# EAGLE design eyewriter_01 (EAGLE 5.11)
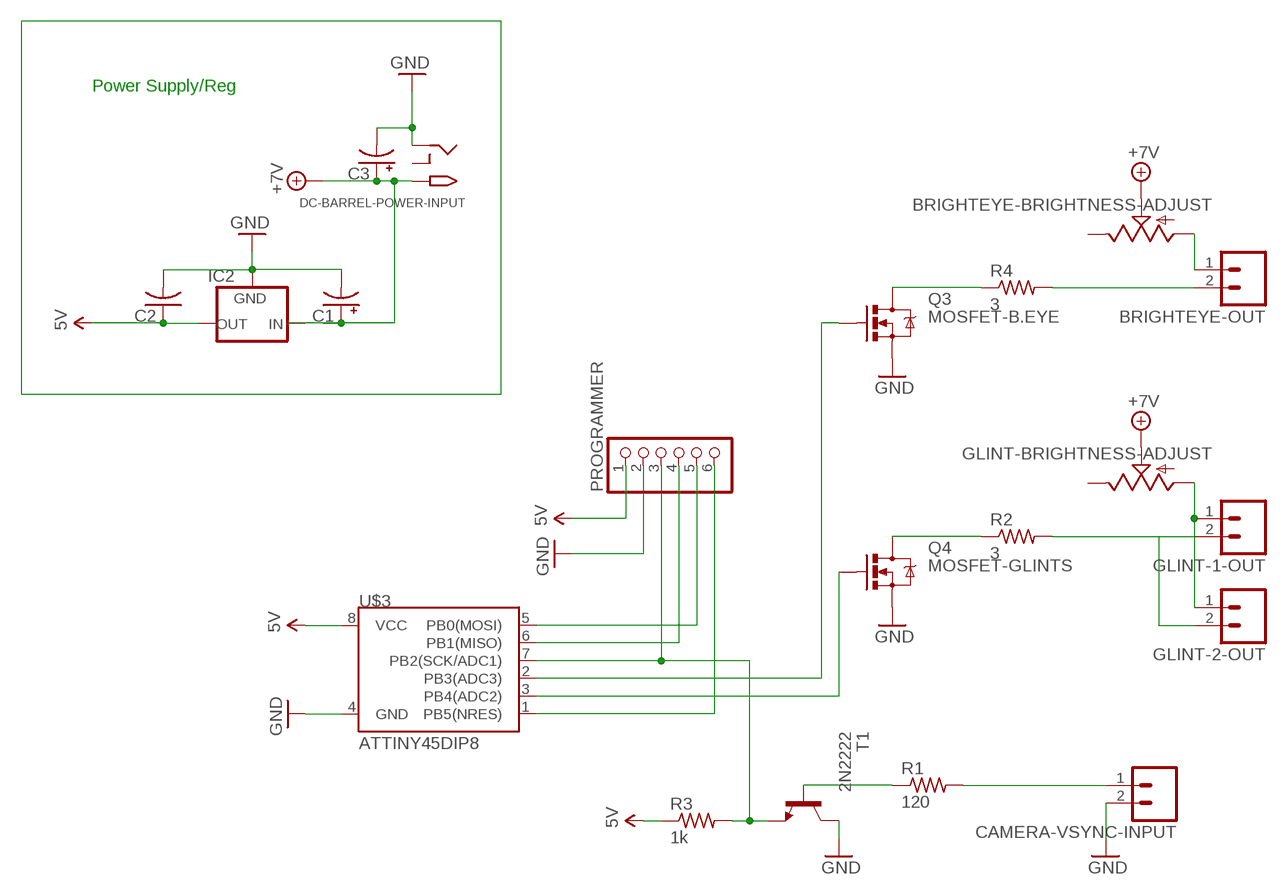
[diagram p0: schematic, sheet 1]

## Parts
BRIGHTEYE-BRIGHTNESS-ADJUST  POT  [ALPS_POT]
BRIGHTEYE-OUT  M02LOCK_LONGPADS  [1X02_LOCK_LONGPADS]
C1  CPOL-USE2-5  [E2-5]
C2  C-US050-030X075  [C050-030X075]
C3  CPOL-USE2-5  [E2-5]
CAMERA-VSYNC-INPUT  M02LOCK_LONGPADS  [1X02_LOCK_LONGPADS]
DC-BARREL-POWER-INPUT  2.1MMJACKTHM  [PJ-102A]
GLINT-1-OUT  M02LOCK_LONGPADS  [1X02_LOCK_LONGPADS]
GLINT-2-OUT  M02LOCK_LONGPADS  [1X02_LOCK_LONGPADS]
GLINT-BRIGHTNESS-ADJUST  POT  [ALPS_POT]
IC2  V_REG_78XXSINK  [TO220-IGO]
PROGRAMMER  PINHD-1X6B  [1X06-BIG]
Q3  MOSFET-B.EYE  MOSFET-NCHANNELPTH2  [TO220V]
Q4  MOSFET-GLINTS  MOSFET-NCHANNELPTH2  [TO220V]
R1  120  R-US_0204/7  [0204/7]
R2  3  R-US_0204/7  [0204/7]
R3  1k  R-US_0204/7  [0204/7]
R4  3  R-US_0204/7  [0204/7]
T1  2N2222  [TO92-EBC-OVAL]
U$3  ATTINY45DIP8  [DIP08]

## Nets
5V: C2.1 IC2.OUT PROGRAMMER.1 R3.1 U$3.8(VCC)
+7V: BRIGHTEYE-BRIGHTNESS-ADJUST.P$2(S) C1.+ C3.+ DC-BARREL-POWER-INPUT.TIP GLINT-BRIGHTNESS-ADJUST.P$2(S) IC2.IN
GND: C1.- C2.2 C3.- CAMERA-VSYNC-INPUT.2 DC-BARREL-POWER-INPUT.RING IC2.GND PROGRAMMER.2 Q3.3(S) Q4.3(S) T1.C U$3.4(GND)
N$1: CAMERA-VSYNC-INPUT.1 R1.2
N$2: R1.1 T1.B
N$3: PROGRAMMER.3 R3.2 T1.E U$3.7(PB2(SCK/ADC1))
N$5: Q4.1(G) U$3.3(PB4(ADC2))
N$6: Q3.1(G) U$3.2(PB3(ADC3))
N$7: Q4.2(D) R2.1
N$8: Q3.2(D) R4.1
N$9: GLINT-1-OUT.2 GLINT-2-OUT.2 R2.2
N$10: BRIGHTEYE-OUT.2 R4.2
N$11: GLINT-1-OUT.1 GLINT-2-OUT.1 GLINT-BRIGHTNESS-ADJUST.P$3(A)
N$12: BRIGHTEYE-BRIGHTNESS-ADJUST.P$3(A) BRIGHTEYE-OUT.1
N$13: PROGRAMMER.5 U$3.5(PB0(MOSI))
N$15: PROGRAMMER.6 U$3.1(PB5(NRES))
N$16: PROGRAMMER.4 U$3.6(PB1(MISO))
Unconnected: BRIGHTEYE-BRIGHTNESS-ADJUST.P$1(E) DC-BARREL-POWER-INPUT.RING_SW GLINT-BRIGHTNESS-ADJUST.P$1(E)

## Notes on the sheet
- Power Supply/Reg

## Library data of the parts
BRIGHTEYE-BRIGHTNESS-ADJUST GLINT-BRIGHTNESS-ADJUST = SparkFun:POT
BRIGHTEYE-OUT CAMERA-VSYNC-INPUT GLINT-1-OUT GLINT-2-OUT = SparkFun:M02: Header 2 Standard 2-pin 0.1" header. Use with straight break away headers (SKU : PRT-00116), right angle break away headers (PRT-00553), swiss pins (PRT-00743), machine pins (PRT-00117), and female headers (PRT-00115). Molex polarized connector foot print use with SKU : PRT-08233 with associated crimp pins and housings.
C1 C3 = adafruit:CPOL-US: POLARIZED CAPACITOR, American symbol
C2 = adafruit:C-US: CAPACITOR, American symbol
DC-BARREL-POWER-INPUT = adafruit:2.1MMJACK: 2.1mm x 5.5mm THM DC jack with internal switch. Digikey part #PJ-102A, 4UCON part #05537 2.1mm x 5.5mm SMT DC jack with internal switch. Digikey part #PJ-002A-SMT, 4UCON part #03267 By microbuilder.eu & adafruit.com
IC2 = SparkFun:V_REG_78XX: Voltage Regulator Standard 7805 5V regulator. IGO (Input Ground Output). Spark Fun Electronics SKU : COM-00107
PROGRAMMER = adafruit:PINHD-1X6: PIN HEADER
Q3 Q4 = SparkFun:MOSFET-NCHANNEL
R1-R4 = adafruit:R-US_: RESISTOR, American symbol
T1 = adafruit:2N2222: NPN TRANSISTOR Big oval pads
U$3 = SparkFun:ATTINY45: Atmel ATTiny45

## Board
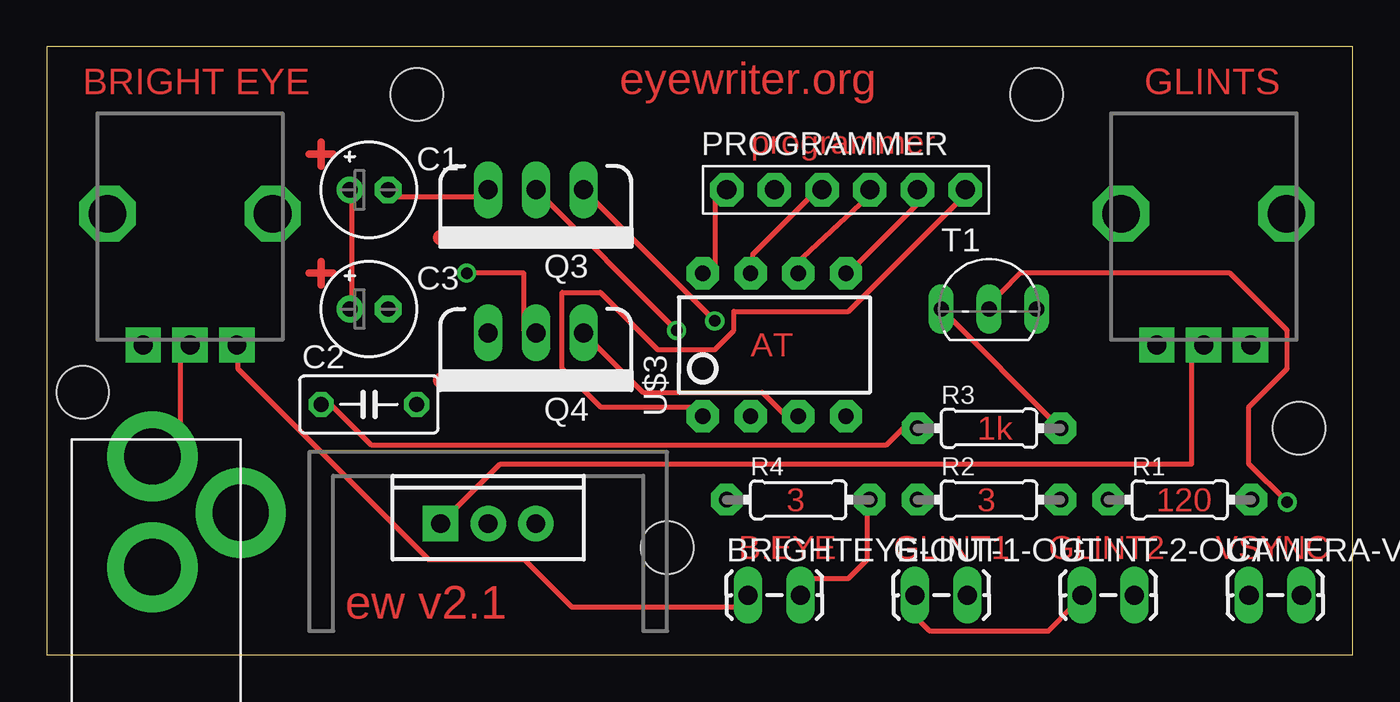
[diagram p1: board, top side]
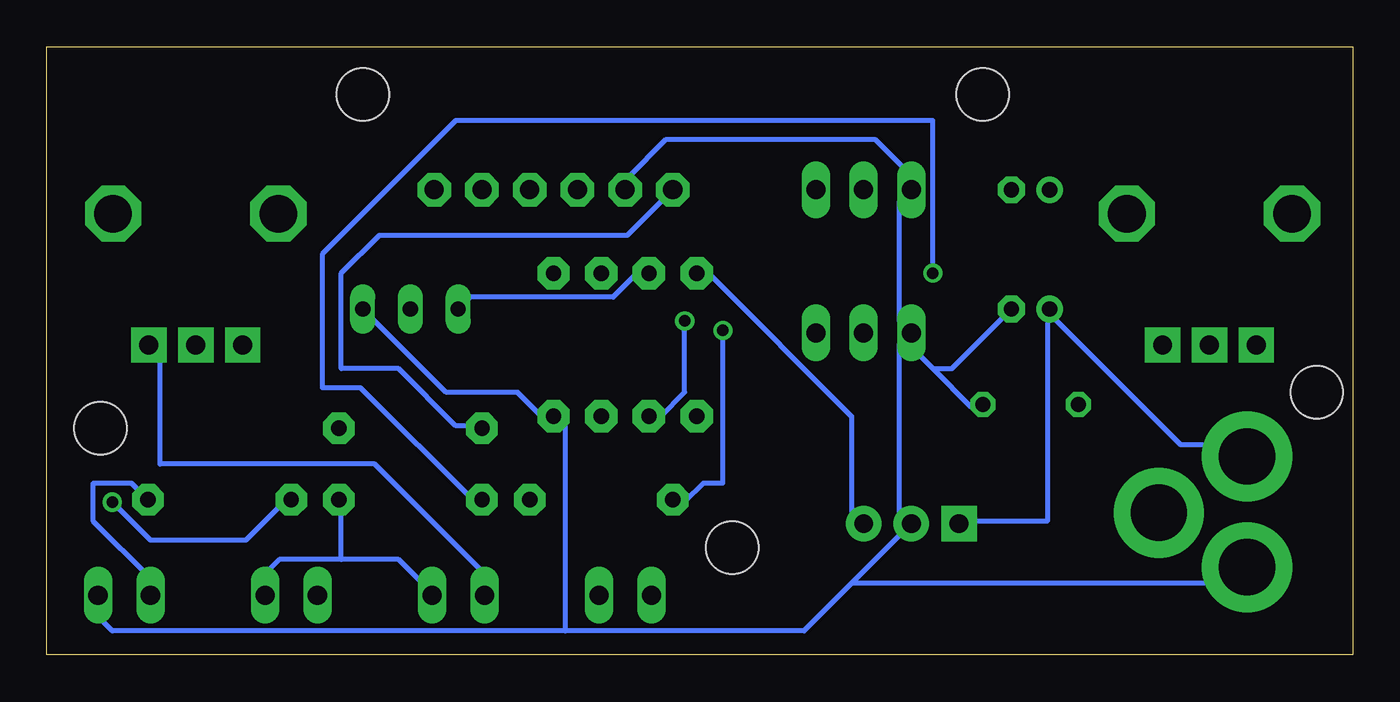
[diagram p2: board, bottom side, seen from below]

Size 69.52 x 32.38 mm. Coordinates in mm from the lower left corner, seen from the top.
Outline: 0,0 69.52,0 69.52,32.38 0,32.38 0,0
Copper layers (1*16): Top 0.035mm / dielectric 1.5mm / Bottom 0.035mm
Design rules "default": minimum track width 10mil, minimum drill 24mil, track to track 8mil, track to pad 8mil, pad to pad 8mil, via to via 8mil, smd to smd 8mil, copper to edge 40mil, drill to drill 8mil, minimum pad ring 10mil, minimum via ring 8mil, stop-mask expansion 4mil, vias tented up to drill 0mil, thermal gap 10mil
Holes 2.8 mm at 19.68,29.84 52.7,29.84 66.67,12.06 33.02,5.71 1.91,13.97

### Footprints (pad centres in the part's own frame; a part is rotated, then mirrored left to right if it is on the bottom)
ALPS_POT = drill 1 pad 1.88 square: P$1 7,-2.5; P$2 7,0; P$3 7,2.5 | drill 2 octagon: P$4 0,-4.4; P$5 0,4.4
1X02_LOCK_LONGPADS = drill 1.016 long: 1 -0.127,0; 2 2.667,0
E2-5 = drill 0.813 pad 1.422 round: + -1.016,0 | drill 0.813 pad 1.422 octagon: - 1.016,0
C050-030X075 = drill 0.813 octagon: 1 -2.54,0; 2 2.54,0
PJ-102A = drill 3 pad 4.8 round: RING 0.1,-3.39; RING_SW -4.6,-6.29; TIP 0.1,-9.29
TO220-IGO = drill 1 pad 1.88 round: GND 0,0; OUT 2.54,0 | drill 1 pad 1.88 square: IN -2.54,0
1X06-BIG = drill 1.016 pad 1.778 octagon: 1 -6.35,0; 2 -3.81,0; 3 -1.27,0; 4 1.27,0; 5 3.81,0; 6 6.35,0
TO220V = drill 1.016 long: 1 -2.54,0; 2 0,0; 3 2.54,0
0204/7 = drill 0.813 pad 1.676 octagon: 1 -3.81,0; 2 3.81,0
TO92-EBC-OVAL = drill 0.813 long: B 0,-1.27; C 2.54,-1.27; E -2.54,-1.27
DIP08 = drill 0.813 pad 1.727 octagon: 1 -3.81,-3.81; 2 -1.27,-3.81; 3 1.27,-3.81; 4 3.81,-3.81; 5 3.81,3.81; 6 1.27,3.81; 7 -1.27,3.81; 8 -3.81,3.81

### Placement (x,y rotation side)
BRIGHTEYE-BRIGHTNESS-ADJUST  7.62,23.5 270 top
BRIGHTEYE-OUT  37.47,3.17 0 top
C1  17.14,24.77 0 top
C2  17.14,13.34 0 top
C3  17.14,18.41 0 top
CAMERA-VSYNC-INPUT  64.14,3.17 0 top
DC-BARREL-POWER-INPUT  5.71,1.27 180 top
GLINT-1-OUT  46.35,3.17 0 top
GLINT-2-OUT  55.24,3.17 0 top
GLINT-BRIGHTNESS-ADJUST  61.59,23.5 270 top
IC2  23.5,6.99 0 top
PROGRAMMER  42.55,24.77 0 top
Q3  26.04,24.77 180 top
Q4  26.04,17.14 180 top
R1  60.33,8.26 0 top
R2  50.16,8.26 0 top
R3  50.16,12.06 0 top
R4  40.01,8.26 0 top
T1  50.16,19.68 0 top
U$3  38.73,16.51 0 top

### Tracks (layer width: path | path; a pad name or v marks a point on that pad's centre or on a via)
5V
  Top 0.254: PROGRAMMER.1 35.56,24.38 35.56,20.32 U$3.8 | C2.1 15.24,13.21 17.27,11.18 44.7,11.18 45.72,12.19 R3.1
  Bottom 0.254: U$3.8 34.29,20.32 26.67,12.7 26.67,7.62 IC2.OUT | PROGRAMMER.1 38.61,22.35 51.82,22.35 53.85,20.32 53.85,15.24 50.8,15.24 47.75,12.19 46.74,12.19 R3.1
+7V
  Top 0.254: GLINT-BRIGHTNESS-ADJUST.P$2 60.96,16.51 60.96,10.16 24.13,10.16 IC2.IN | C3.+ 16.26,18.29 16.26,24.38 C1.+ | BRIGHTEYE-BRIGHTNESS-ADJUST.P$2 7.11,16.26 7.11,11.18 6.1,11.18 DC-BARREL-POWER-INPUT.TIP
  Bottom 0.254: C1.+ 15.88,24.77 | BRIGHTEYE-BRIGHTNESS-ADJUST.P$2 | 16.26,18.29 9.14,11.18 6.1,11.18 DC-BARREL-POWER-INPUT.TIP | 16.26,18.29 16.26,7.11 20.32,7.11 IC2.IN | 16.26,18.29 C3.+
GND
  Top 0.254: C1.- 18.29,24.38 23.37,24.38 Q3.3
  Bottom 0.254: T1.C 48.26,13.97 44.45,13.97 43.18,12.7 U$3.4 41.91,12.7 41.91,1.27 | Q4.3 24.13,17.78 24.13,24.13 Q3.3 23.37,25.4 25.4,27.43 36.58,27.43 38.61,25.4 PROGRAMMER.2 | 41.91,1.27 29.21,1.27 26.67,3.81 | 41.91,1.27 66.04,1.27 67.31,2.54 CAMERA-VSYNC-INPUT.2 | 26.67,3.81 IC2.GND 24.13,7.62 24.13,16.51 Q4.3 | 26.67,3.81 6.35,3.81 DC-BARREL-POWER-INPUT.RING | 22.35,15.24 23.37,16.26 Q4.3 | 22.35,15.24 20.32,13.21 C2.2 | 22.35,15.24 21.34,15.24 C3.-
N$1
  Bottom 0.254: CAMERA-VSYNC-INPUT.1 64.01,4.06 67.06,7.11 67.06,9.14 65.02,9.14 R1.2 64.01,8.13
N$2  (via drill 0.61)
  Top 0.254: v66.04,8.13 64.01,10.16 64.01,13.21 66.04,15.24 66.04,17.27 62.99,20.32 51.82,20.32 50.8,19.3 T1.B
  Bottom 0.254: v66.04,8.13 64.01,6.1 58.93,6.1 56.9,8.13 R1.1
N$3
  Top 0.254: T1.E R3.2 | PROGRAMMER.3 40.64,24.38 37.59,21.34 37.59,20.32 U$3.7
  Bottom 0.254: T1.E 46.99,19.05 39.37,19.05 38.1,20.32 U$3.7
N$5
  Top 0.254: Q4.1 31.75,13.97 38.1,13.97 39.37,12.7 U$3.3
N$6  (via drill 0.61)
  Top 0.254: v35.56,17.78 Q3.1
  Bottom 0.254: v35.56,17.78 35.56,13.97 36.83,12.7 U$3.2
N$7  (via drill 0.61)
  Top 0.254: v22.35,20.32 25.4,20.32 25.4,17.27 Q4.2
  Bottom 0.254: v22.35,20.32 22.35,28.45 47.75,28.45 54.86,21.34 54.86,14.22 52.83,14.22 46.74,8.13 R2.1
N$8  (via drill 0.61)
  Top 0.254: v33.53,17.27 Q3.2
  Bottom 0.254: v33.53,17.27 33.53,9.14 34.54,9.14 35.56,8.13 R4.1
N$9
  Bottom 0.254: 53.85,5.08 50.8,5.08 49.53,3.81 GLINT-1-OUT.2 | 53.85,5.08 57.15,5.08 58.42,3.81 GLINT-2-OUT.2 | 53.85,5.08 53.85,8.13 R2.2
N$10
  Top 0.254: 40.01,3.17 BRIGHTEYE-OUT.2 40.64,4.06 42.67,4.06 43.69,5.08 43.69,8.13 R4.2
N$11
  Top 0.254: GLINT-1-OUT.1 45.72,2.54 46.99,1.27 53.34,1.27 54.61,2.54 GLINT-2-OUT.1
  Bottom 0.254: GLINT-BRIGHTNESS-ADJUST.P$3 63.5,16.51 63.5,10.16 52.07,10.16 45.72,3.81 GLINT-1-OUT.1
N$12
  Top 0.254: BRIGHTEYE-OUT.1 36.83,2.54 27.94,2.54 25.4,5.08 20.32,5.08 10.16,15.24 10.16,16.51 BRIGHTEYE-BRIGHTNESS-ADJUST.P$3
N$13
  Top 0.254: U$3.5 42.67,20.32 46.74,24.38 PROGRAMMER.5
N$14
  Top 0.406: 14.61,26.04 14.61,27.3
N$15
  Top 0.254: U$3.1 34.54,13.21 29.46,13.21 27.43,15.24 27.43,19.3 29.46,19.3 32.51,16.26 35.56,16.26 36.58,17.27 36.58,18.29 42.67,18.29 48.77,24.38 PROGRAMMER.6
N$16
  Top 0.254: U$3.6 40.64,20.32 39.88,20.83 43.69,24.38 PROGRAMMER.4
N$17
  Top 0.254: 21.34,14.61 21.34,14.22
  Top 0.813: 20.95,14.61 21.34,14.61 23.5,14.61
N$18
  Top 0.406: 13.97,26.67 15.24,26.67
N$19
  Top 0.406: 14.61,19.68 14.61,20.95
N$20
  Top 0.406: 13.97,20.32 15.24,20.32
N$23
  Top 0.254: 21.34,22.35 21.34,22.23
  Top 0.813: 20.95,22.23 21.34,22.23 23.5,22.23

### Text on the board
Top: BRIGHT EYE | eyewriter.org | GLINTS | programmer | AT | 1k | 3 | 3 | 120 | B.EYE | GLINT1 | GLINT2 | VSYNC | ew v2.1